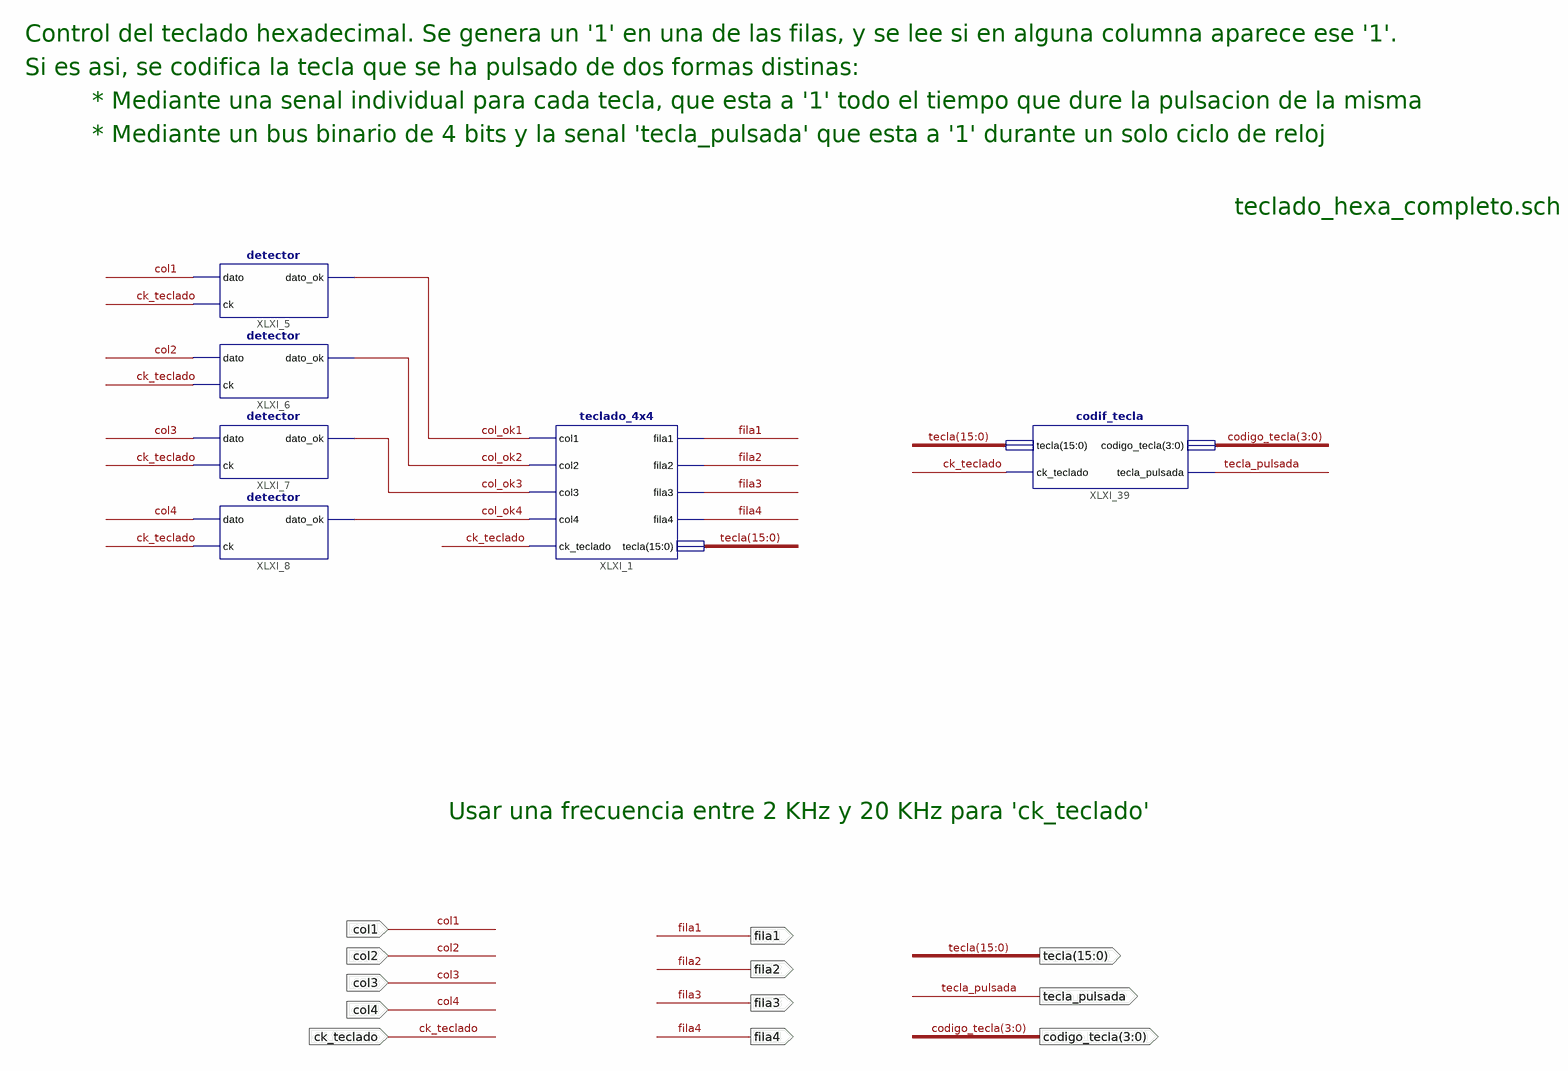
[diagram p0: schematic sheet 1]
// Xilinx ISE schematic teclado_hexa_completo.sch (spartan6) as structural Verilog: 6 symbols, 12 ports
module teclado_hexa_completo (
  input  ck_teclado,
  input  col1,
  input  col2,
  input  col3,
  input  col4,
  output fila1,
  output fila2,
  output fila3,
  output fila4,
  output tecla_pulsada,
  output [3:0] codigo_tecla,
  output [15:0] tecla
);

  wire col_ok1, col_ok2, col_ok3, col_ok4;

  codif_tecla XLXI_39 (
    .ck_teclado(ck_teclado), .codigo_tecla(codigo_tecla), .tecla_pulsada(tecla_pulsada), .tecla(tecla));
  detector XLXI_5 (.dato(col1), .ck(ck_teclado), .dato_ok(col_ok1));
  detector XLXI_6 (.dato(col2), .ck(ck_teclado), .dato_ok(col_ok2));
  detector XLXI_7 (.dato(col3), .ck(ck_teclado), .dato_ok(col_ok3));
  detector XLXI_8 (.dato(col4), .ck(ck_teclado), .dato_ok(col_ok4));
  teclado_4x4 XLXI_1 (
    .col1(col_ok1), .col2(col_ok2), .col3(col_ok3), .col4(col_ok4), .tecla(tecla), .fila4(fila4),
    .fila1(fila1), .fila2(fila2), .fila3(fila3), .ck_teclado(ck_teclado));

  // Notes on the sheet:
  //   Control del teclado hexadecimal. Se genera un '1' en una de las filas, y se lee si en alguna columna aparece ese '1'.
  //   Si es asi, se codifica la tecla que se ha pulsado de dos formas distinas:
  //   * Mediante una senal individual para cada tecla, que esta a '1' todo el tiempo que dure la pulsacion de la misma
  //   * Mediante un bus binario de 4 bits y la senal 'tecla_pulsada' que esta a '1' durante un solo ciclo de reloj
  //   teclado_hexa_completo.sch
  //   Usar una frecuencia entre 2 KHz y 20 KHz para 'ck_teclado'
endmodule
